# Altium schematic sheet ImpedanceMatcher.SchDoc
size A4; SheetNumber: 1; SheetTotal: 1
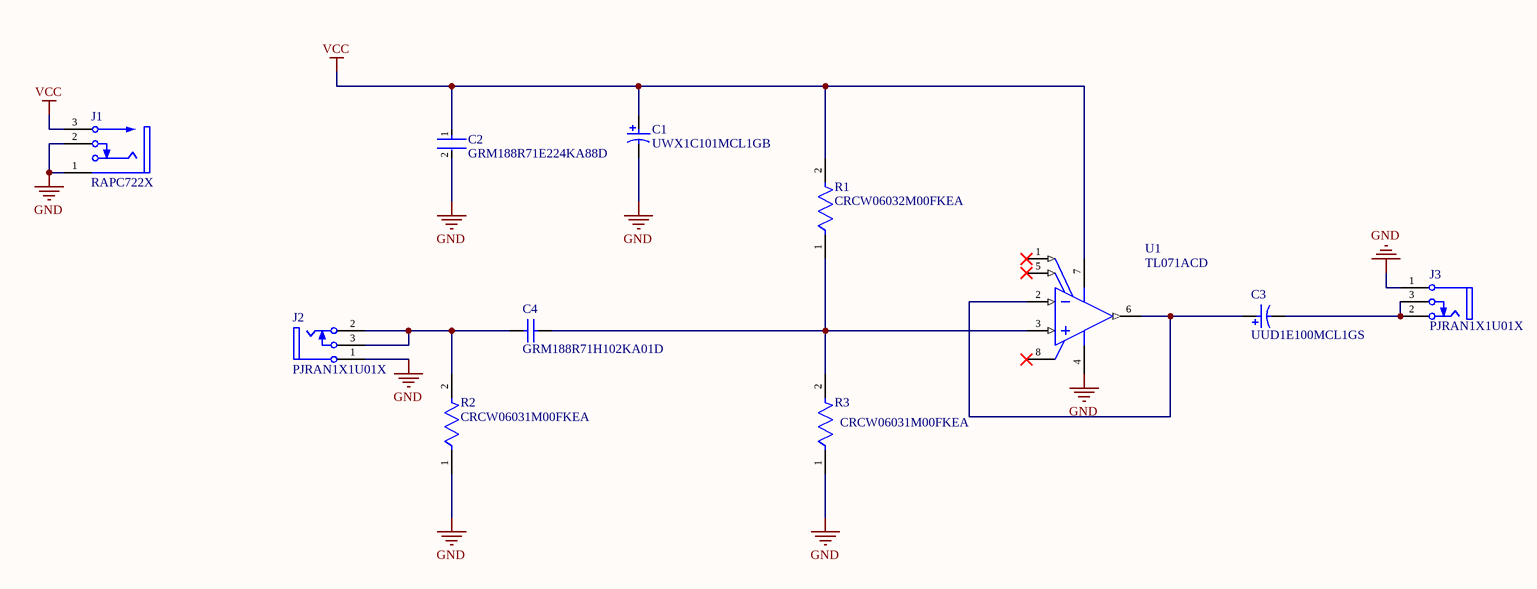
[diagram p0: ImpedanceMatcher.SchDoc]

## Parts
C1  UWX1C101MCL1GB  [CAPAE7067X55L]
C2  GRM188R71E224KA88D  [FP-GRM188-0_1-e0_2_0_5-IPC_C]
C3  UUD1E100MCL1GS  [NIC-CAPA2-4X5.8_V]
C4  GRM188R71H102KA01D  [CAPC1608X90X35NL10T15]
J1  RAPC722X  [SWITCH-RAPC712X-3_V]
J2  PJRAN1X1U01X  [SWIT-PJRAN1X1U01X_V]
J3  PJRAN1X1U01X  [SWIT-PJRAN1X1U01X_V]
R1  CRCW06032M00FKEA  [FP-CRCW0603-e3-IPC_A]
R2  CRCW06031M00FKEA  [FP-CRCW0603-e3-MFG]
R3  CRCW06031M00FKEA  [FP-CRCW0603-e3-MFG]
U1  TL071ACD  [D0008A_M]

## Nets
GND: C1.2 C2.2 J1.1 J1.2 J2.1(SLEEVE) J3.1(SLEEVE) R2.1 R3.1 U1.4(VCC-)
VCC: C1.1 C2.1 J1.3 R1.2 U1.7(VCC+)
NetC3_1: C3.1 U1.2(IN-) U1.6(OUT)
NetC3_2: C3.2 J3.2(TIP) J3.3(SHUNT)
NetC4_1: C4.1 J2.2(TIP) J2.3(SHUNT) R2.2
NetC4_2: C4.2 R1.1 R3.2 U1.3(IN+)

Not connected (* = marked no-connect by the designer): U1 1(OFFSET_N1)* 5(OFFSET_N2)* 8(NC)*

## Library data of the parts
C1 = CMP-2000-07374-1: Aluminum Electrolytic Capacitor, 100 uF, +/- 20%, 16 V, -40 to 85 degC, 2-Pin SMD, RoHS, Tape and Reel; Manufacturer: Nichicon; Type: Can; Rated Voltage: 16V; Capacitance: 100µF; Case Size/Dimension: Ø6.3x5.4mm; Mounting Technology: SurfaceMount; Datasheet Version: 08/2015; Operating Temp-Max: 85°C; Datasheet URL: http://nichicon-us.com/english/products/pdfs/e-uwx.pdf; Package Description: 2-Pin Surface Mount Device, Body 6.6 x 6.6 mm; Package Reference: CAPAE7067X55; Manufacturer URL: http://www.nichicon.co.jp/english/
C2 = CMP-1035-02648-3: Chip Multilayer Ceramic Capacitors for General Purpose, 0603, 0.22uF, X7R, 15%, 10%, 25V; Voltage: 50V; Capacitance: 220nF; Number of Pins: 2; Length: 1.6mm; Material: Ceramic; Depth: 0.8mm; REACH SVHC: No SVHC; Voltage Rating (DC): 25V; Tolerance: 10%; Max Operating Temperature: 125°C; Lead Free: Lead Free; Package Quantity: 1; Voltage Rating: 25V; Width: 0.8mm; Case Code (Metric): 1608; Min Operating Temperature: -55°C; Case/Package: 0603; Mount: Surface Mount; Dielectric: X7R; Height: 0.8mm; Termination: SMD/SMT; Radiation Hardening: No; Case Code (Imperial): 0603; Thickness: 0.035inch; Packaging: Tape and Reel
C3 = CMP-0687-00016-1: Aluminum Electrolytic Capacitor, UD Series, Low Impedance, 10 uF, 25 V, + / - 20%, -55 to 105 degC, Chip Type, 4 x 5.8 mm D x L, Pb-Free, Reel; Manufacturer: Nichicon; Endurance Time: 2000 h; Packing: Dia382mm Reel; Rated Ripple Current (at 100kHz): 80 mA; Tolerance Rated Capacitance: -20 to 20%; Impedance: 1.8 Ohm; Rated Capacitance: 10 uF; Rated Voltage: 25 V; ComponentLink3URL: http://products.nichicon.co.jp/en/pdf/XJA043/e-ud.pdf; ComponentLink1Description: Manufacturer URL; DatasheetVersion: 08/2012; ComponentLink3Description: Package Specification; ComponentLink2Description: Datasheet; ComponentLink2URL: http://products.nichicon.co.jp/en/pdf/XJA043/e-ud.pdf; ComponentLink1URL: http://www.nichicon.co.jp/; Length: 5.8 mm; RoHS: TRUE; Diameter: 4 mm; Mounting Technology: Surface Mount; PackageDescription: 2-Pin Surface Mount Device, Diameter 4 mm, Height 5.8 mm, Pitch 3.6 mm; PartNumber: UUD1E100MCL1GS; PackageReference: CAPAE-D4H5.8
C4 = CMP-2006-02891-1: Manufacturer: Murata; Part Number: GRM188R71H102KA01D
J1 = CMP-2000-05384-1: Power Jack, 5 A, 3-Pin THD, RoHS, Bulk; Manufacturer: Switchcraft; Current Rating: 5A; Plug/Mating Plug Diameter: 2.1mmID,5.5mmOD; Gender: Male; Mating Products: S765-ND / -CONNPLUGMINIPWR2CONDWHT/RED / S760K-ND / -CONNPOWERPLUGMINI.08"BLACK / SC1052-ND / -CONNPOWERPLUGMINIBLACK; Number of Positions/Contacts: 2Conductors,2Contacts; Internal Switch(s): SingleSwitch,NormallyClosed; Shielding: Unshielded; Catalog Drawings: RAPC7(1,2)2XSide / RAPC7(1,2)2XTop; Dynamic Catalog: SwitchcraftInc; Other Names: Q2287470A / RAPC722X-ND / SC1313; Standard Package: 2,500; Termination: SolderEyelet(s); Family: Barrel-PowerConnectors; Housing Color: Black; Housing Material: Thermoplastic; RoHS Information: SwitchcraftRoHSInfo; Color: Black; Contact Material - Plating: Nickel; Mounting Type: ThroughHole,RightAngle; Manufacturer URL: http://www.switchcraft.com/; Contact Material: Brass; Datasheet Version: Rev. A, 08/2005; Connector Type: Jack; Category: Connectors,Interconnects; Datasheet URL: http://www.mouser.com/ds/2/393/rapc722x_cd-371352.pdf
J2 J3 = CMP-1772-00003-1: Female Phono Jack, 3 Position, Height 13 mm, Tail Length 4 mm, RoHS, Bulk; Case\Package: Radial; Type (Capacitors): X7R; Tolerance: 10%; Voltage Rating (DC): 50 V; Capacitance: 100 nF; Package Quantity: 500; Mount: Through Hole; Packaging: Bulk; Height: 3.18 mm; Min Operating Temperature: -55 degC; Radiation Hardening: No; PackageDescription: Female Phono Jack, 3 Position, Height 13 mm, Tail Length 4 mm; Length: 6.6 mm; Lead Pitch: 2.54 mm; Width: 5.08 mm; REACH SVHC: No SVHC; ComponentLink1Description: Manufacturer URL; Max Operating Temperature: 125 degC; ComponentLink2Description: Datasheet; DatasheetVersion: Rev. A, 01/2006; Voltage Rating: 50 V; ComponentLink2URL: http://www.conxall.com/Drawings/pjran1x1u__x_series_cd.pdf; ComponentLink1URL: http://www.switchcraft.com/; RoHSCompliant: true; Pins: 2; PackageReference: PJRAN1X1U01X
R1 = CMP-2000-03189-2: RES Thick Film, 2MΩ, 1%, 0.1W, 100ppm/°C, 0603; Max Power Dissipation: 100mW; Resistance: 2MR; Voltage Rating (DC): 75V; Packaging: Tape and Reel; Temperature Coefficient: 100ppm/°C; Width: 0.033inch; Depth: 0.85mm; Contact Plating: Tin; Length: 1.55mm; Military Standard: Not; Features: Automotive AEC-Q200; Number of Pins: 2; Radiation Hardening: No; Case Code (Imperial): 0603; Weight: 7.1E-05oz; Case Code (Metric): 1608; Max Operating Temperature: 155°C; Voltage Rating: 75V; Number of Terminations: 2; Case/Package: 0603; Min Operating Temperature: -55°C; Composition: Thick Film; Height: 0.45mm; Tolerance: 1%; Package Quantity: 10; Termination: SMD/SMT; Working Voltage: 75V; Power Rating: 100mW; Lead Free: Lead Free
R2 R3 = CMP-2000-03013-2: RES Thick Film, 1MΩ, 1%, 0.1W, 100ppm/°C, 0603; Max Power Dissipation: 100mW; Resistance: 1MR; Voltage Rating (DC): 75V; Depth: 0.85mm; Max Operating Temperature: 155°C; Length: 1.55mm; Power Rating: 100mW; Military Standard: Not; Features: Automotive AEC-Q200; Min Operating Temperature: -55°C; Number of Pins: 2; Mount: Surface Mount; Package Quantity: 10; Packaging: Tape and Reel; Height: 0.45mm; Radiation Hardening: No; Case Code (Metric): 1608; Temperature Coefficient: 100ppm/°C; Width: 0.85mm; Composition: Thick Film; Termination: SMD/SMT; Tolerance: 1%; Number of Terminations: 2; Lead Free: Lead Free; Contact Plating: Tin; Case/Package: 0603; Weight: 7.1E-05oz; Voltage Rating: 75V; Case Code (Imperial): 0603
U1 = CMP-0017-00458-2: Low-Noise JFET-Input Operational Amplifier, 7 to 36 V, 0 to 70 degC, 8-pin SOIC (D8), Green (RoHS & no Sb/Br); Manufacturer: Texas Instruments; GBW(Typ)(MHz): 3; Sub Family: General Purpose Amplifier, High Supply Voltage Amplifier (>=30V); Rating: Catalog; CMRR(Min)(dB): 75; Iq per channel(Max)(mA): 2.5; IIB(Max)(pA): 200; Number of Channels: 1; Vio (25C)(Max)(mV): 6; Vn at 1kHz(Typ)(nV/rtHz): 18; Slew Rate(Typ)(V/us): 13; Total Supply Voltage(Max)(+5V is 5, +/-5V is 10): 36; Total Supply Voltage(Min)(+5V is 5, +/-5V is 10): 7; ComponentLink1Description: Manufacturer URL; Code_JEDEC: MS-012; PartNumber: TL071ACD; PackageReference: D0008A; DatasheetVersion: SLOS080J; Mounting Technology: Surface Mount; PackageVersion: 4040047-3/M, 06/2011; PackageDescription: 8-Pin Plastic Small Outline, Body 4.9 x 3.9 mm, Pitch 1.27 mm; ComponentLink2URL: http://www.ti.com/lit/ds/symlink/tl071a.pdf; ComponentLink3URL: http://www.ti.com/litv/pdf/msoi002j; Eco-Plan: Green (RoHS & no Sb/Br); ComponentLink1URL: http://www.ti.com/; ComponentLink2Description: Datasheet; ComponentLink3Description: Package Specification; Offset Drift(Typ)(uV/C): 18